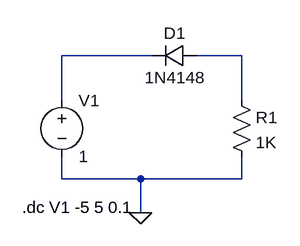
[diagram p0: schematic diode2.asc]
diode2.asc, the LTspice schematic file:
Version 4
SHEET 1 880 680
WIRE 128 64 0 64
WIRE 256 64 192 64
WIRE 0 128 0 64
WIRE 256 128 256 64
WIRE 0 240 0 208
WIRE 112 240 0 240
WIRE 256 240 256 208
WIRE 256 240 112 240
WIRE 112 288 112 240
FLAG 112 288 0
SYMBOL voltage 0 112 R0
WINDOW 123 0 0 Left 0
WINDOW 39 0 0 Left 0
SYMATTR InstName V1
SYMATTR Value 1
SYMBOL diode 192 48 R90
WINDOW 0 0 32 VBottom 2
WINDOW 3 32 32 VTop 2
SYMATTR InstName D1
SYMATTR Value 1N4148
SYMBOL res 240 112 R0
SYMATTR InstName R1
SYMATTR Value 1K
TEXT -56 280 Left 2 !.dc V1 -5 5 0.1

The netlist it stands for:
* diode2.asc
V1 N001 0 1
D1 N002 N001 1N4148
R1 N002 0 1K
.model D D
.lib standard.dio
.dc V1 -5 5 0.1
.backanno
.end

* Results of the author's LTspice run, read from the files saved beside the schematic
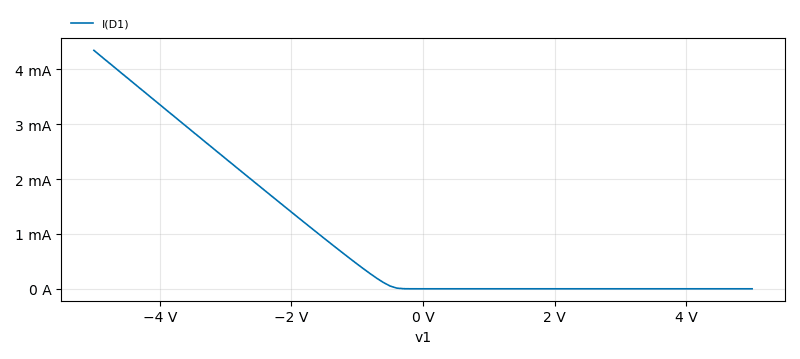
[diagram p1: DC transfer characteristic of diode2.asc, plotted from the saved traces]
* DC transfer characteristic, 1 run:
*   I(D1): 4.347 mA at v1=-5 V, -2.525 nA at v1=5 V, min -2.525 nA, max 4.347 mA